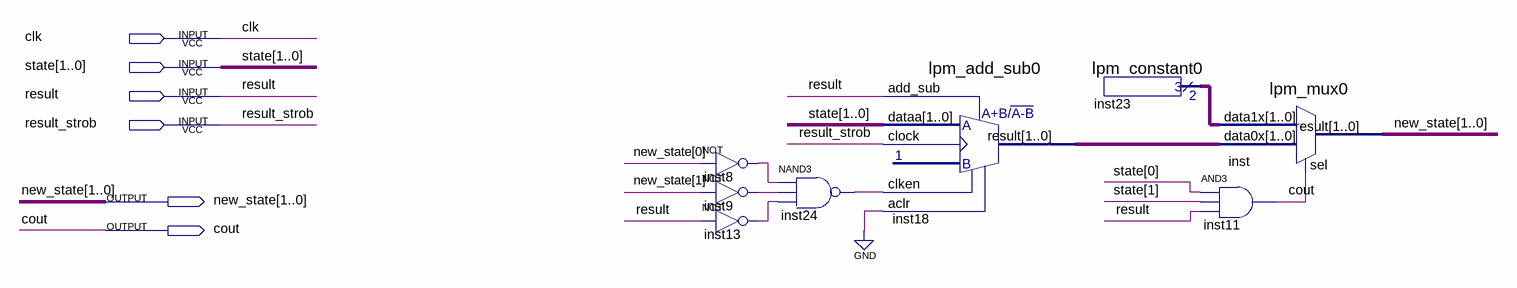
[diagram p0: schematic sheet]
// Quartus schematic MACHINE_A3.bdf as structural Verilog: 8 symbols, 6 pins
module MACHINE_A3 (
  input  clk,
  input  [1:0] state,
  input  result,
  input  result_strob,
  output [1:0] new_state,
  output cout
);

  wire inst8_out, inst9_out, inst13_out, inst24_out;
  wire [1:0] inst18_result, inst23_result;

  not inst8 (inst8_out, new_state[0]);
  not inst9 (inst9_out, new_state[1]);
  not inst13 (inst13_out, result);
  nand inst24 (inst24_out, inst8_out, inst9_out, inst13_out);
  lpm_add_sub0 inst18 (
    .dataa(state), .clock(result_strob), .add_sub(result), .clken(inst24_out), .aclr(1'b0),
    .result(inst18_result));
  lpm_constant0 inst23 (.result(inst23_result));
  lpm_mux0 inst (.data1x(inst23_result), .data0x(inst18_result), .sel(cout), .result(new_state));
  and inst11 (cout, state[0], state[1], result);
endmodule
